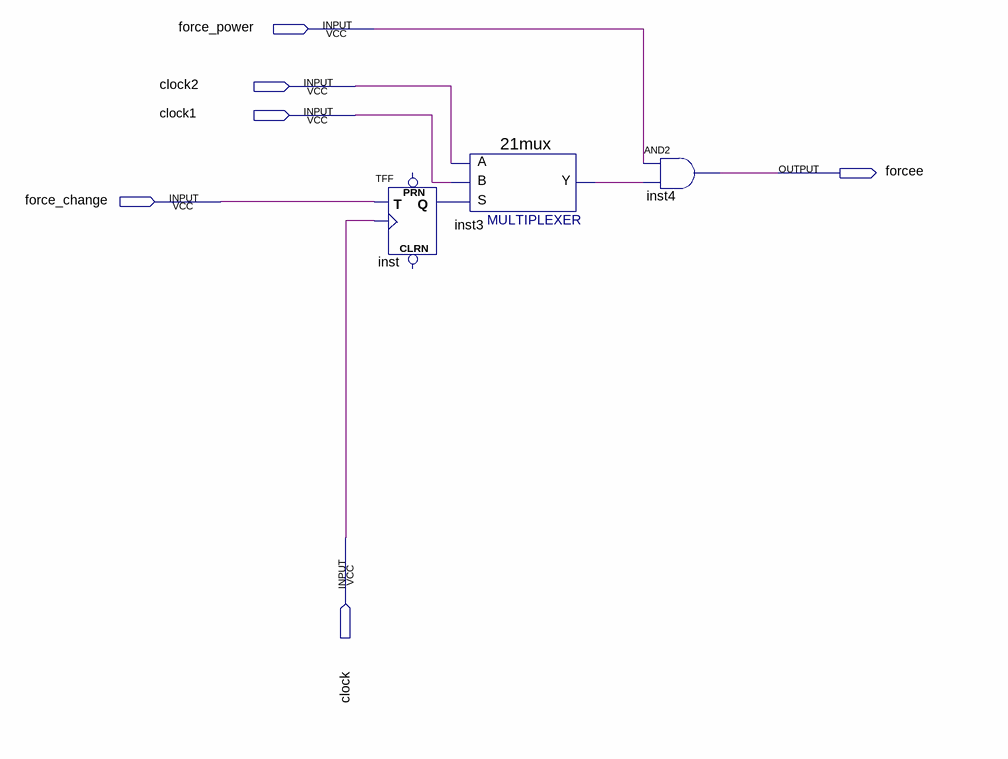
[diagram p0: schematic sheet]
// Quartus schematic massage.bdf as structural Verilog: 3 symbols, 6 pins
module massage (
  input  force_power,
  input  clock2,
  input  clock1,
  input  force_change,
  input  clock,
  output forcee
);

  wire inst3_y, inst_q;

  TFF inst (.T(force_change), .CLK(clock), .Q(inst_q));  // open: PRN, CLRN
  \21mux  inst3 (.S(inst_q), .B(clock1), .A(clock2), .Y(inst3_y));
  and inst4 (forcee, force_power, inst3_y);
endmodule
